# EAGLE schematic reprap_modular_electronics_slave (EAGLE 5.11)
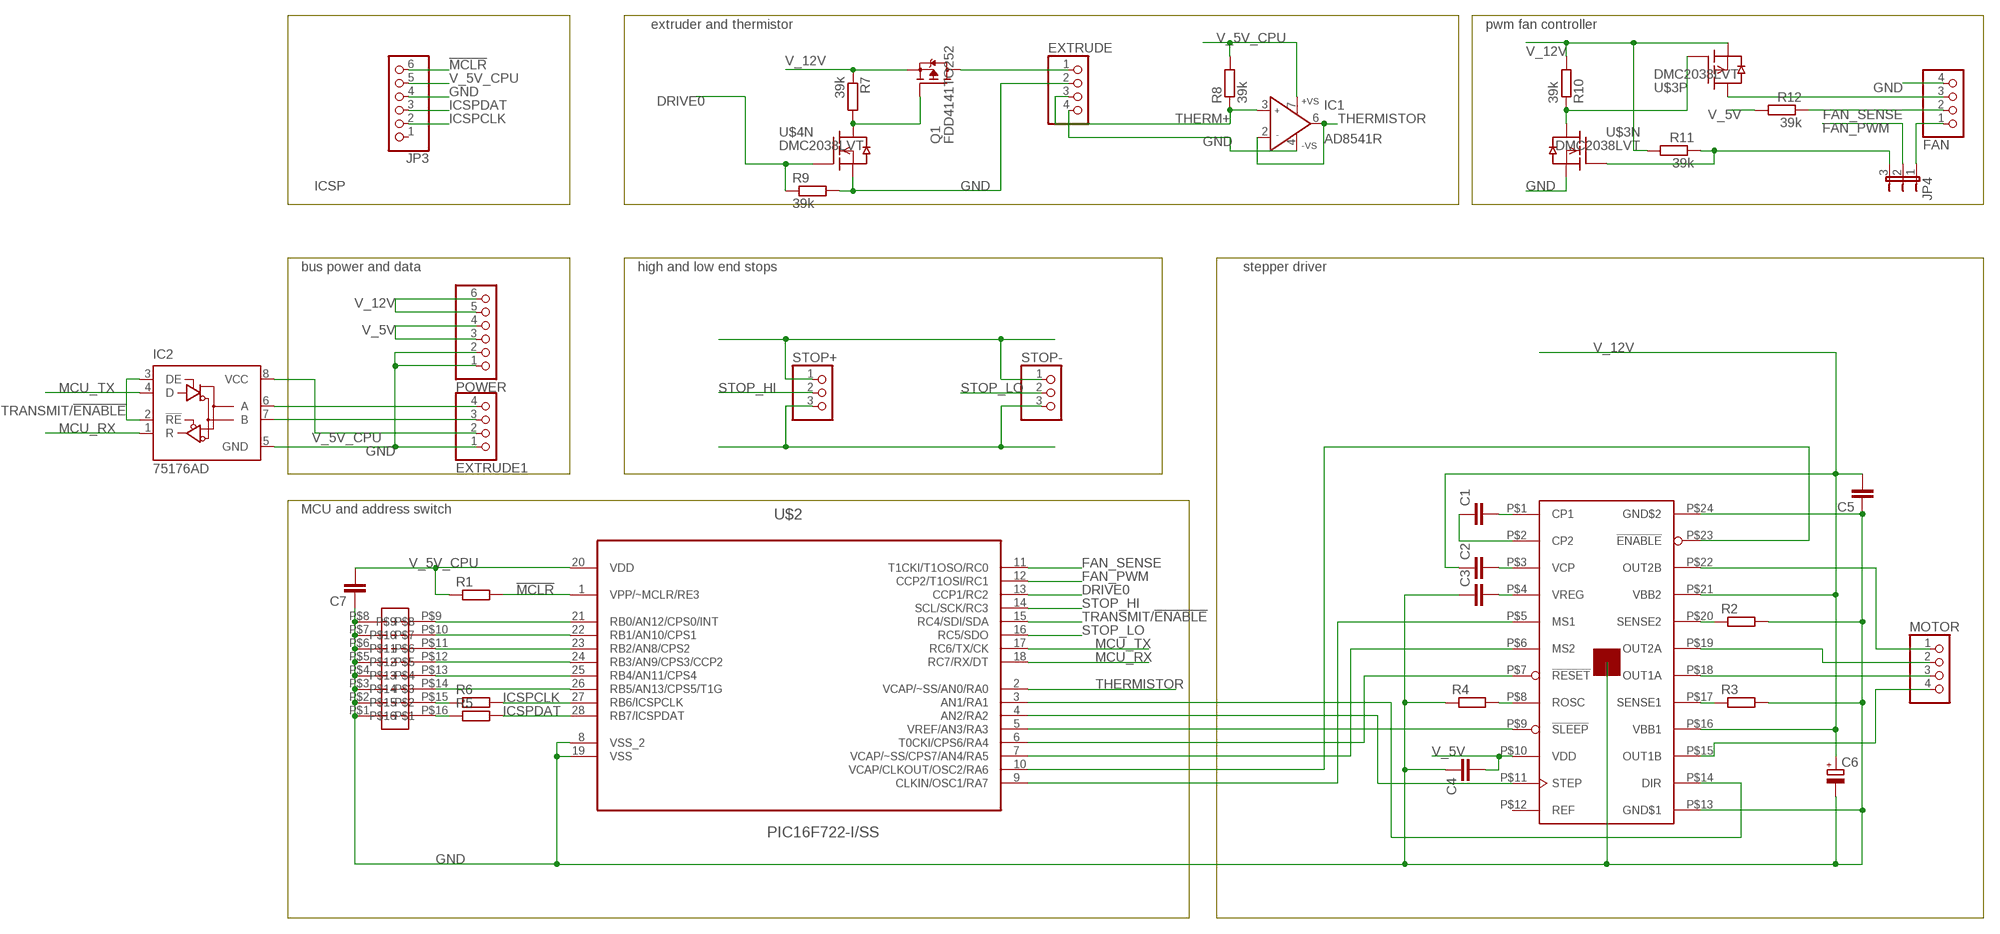
[diagram p0: schematic, sheet 1]

## Parts
ADDRESS  8WAYJUMPER  [8WAYJUMPER]
C1  C-EUC0603K  [C0603K]
C2  C-EUC0603K  [C0603K]
C3  C-EUC0603K  [C0603K]
C4  C-EUC0603K  [C0603K]
C5  C-EUC0603K  [C0603K]
C6  CPOL-EUE2-5  [E2-5]
C7  C-EUC0603K  [C0603K]
EXTRUDE  PINHD-1X4/90  [1X04/90]
EXTRUDE1  PINHD-1X4/90  [1X04/90]
FAN  PINHD-1X4/90  [1X04/90]
IC1  AD8541R  [SO8]
IC2  75176AD  [D_R-PDSO-G8]
JP3  PINHD-1X6/90  [1X06/90]
JP4  JP2E  [JP2]
MOTOR  PINHD-1X4/90  [1X04/90]
POWER  PINHD-1X6/90  [1X06/90]
Q1  FDD4141TO252  [TO252]
R1  R-EU_R0603  [R0603]
R2  R-EU_R0805  [R0805]
R3  R-EU_R0805  [R0805]
R4  R-EU_R0603  [R0603]
R5  R-EU_R0603  [R0603]
R6  R-EU_R0603  [R0603]
R7  39k  R-EU_R0603  [R0603]
R8  39k  R-EU_R0603  [R0603]
R9  39k  R-EU_R0603  [R0603]
R10  39k  R-EU_R0603  [R0603]
R11  39k  R-EU_R0603  [R0603]
R12  39k  R-EU_R0603  [R0603]
STOP+  PINHD-1X3/90  [1X03/90]
STOP-  PINHD-1X3/90  [1X03/90]
U$1  A4982  [TSSOP24]
U$2  PIC16F722-I/SS  [SOP65P780X200-28N]
U$3  DMC2038LVT  [SOT23-6]
U$4  DMC2038LVT  [SOT23-6]

## Nets
!ENABLE: U$1.P$23(!ENABLE) U$2.10(VCAP/CLKOUT/OSC2/RA6)
!MCLR: JP3.6 R1.2 U$2.1(VPP/~MCLR/RE3)
!RESET: U$1.P$7(!RESET) U$2.6(T0CKI/CPS6/RA4)
!SLEEP: U$1.P$9(!SLEEP) U$2.5(VREF/AN3/RA3)
DIR: U$1.P$14(DIR) U$2.3(AN1/RA1)
DRIVE0: R9.1 U$2.13(CCP1/RC2) U$4.1(N:G)
FAN_POWER: FAN.3 U$3.4(P:D)
FAN_PWM: JP4.2 U$2.12(CCP2/T1OSI/RC1)
FAN_SENSE: FAN.2 R12.1 U$2.11(T1CKI/T1OSO/RC0)
GND: ADDRESS.P$1 ADDRESS.P$2 ADDRESS.P$3 ADDRESS.P$4 ADDRESS.P$5 ADDRESS.P$6 ADDRESS.P$7 ADDRESS.P$8 C3.1 C4.1 C5.1 C6.- C7.1 EXTRUDE1.1 EXTRUDE.2 EXTRUDE.4 FAN.4 IC1.4(-VS) IC2.5(GND) JP3.4 POWER.1 POWER.2 R2.2 R3.2 R4.1 R9.2 STOP+.3 STOP-.3 U$1.EP(GND$0) U$1.P$13(GND$1) U$1.P$24(GND$2) U$2.8(VSS_2) U$2.19(VSS) U$3.5(N:S) U$4.5(N:S)
ICSPCLK: JP3.2 R6.2 U$2.27(RB6/ICSPCLK)
ICSPDAT: JP3.3 R5.2 U$2.28(RB7/ICSPDAT)
MCU_RX: IC2.1(R) U$2.18(RC7/RX/DT)
MCU_TX: IC2.4(D) U$2.17(RC6/TX/CK)
MS2: U$1.P$6(MS2) U$2.7(VCAP/~SS/CPS7/AN4/RA5)
N$1: EXTRUDE.1 Q1.2(D)
N$2: U$1.P$5(MS1) U$2.9(CLKIN/OSC1/RA7)
N$3: R10.1 U$3.3(P:G) U$3.6(N:D)
N$4: FAN.1 JP4.1
N$6: Q1.1(G) R7.2 U$4.6(N:D)
N$7: JP4.3 R11.1 U$3.1(N:G)
N$8: MOTOR.1 U$1.P$22(OUT2B)
N$9: MOTOR.2 U$1.P$19(OUT2A)
N$10: MOTOR.3 U$1.P$18(OUT1A)
N$11: MOTOR.4 U$1.P$15(OUT1B)
N$12: R2.1 U$1.P$20(SENSE2)
N$13: R3.1 U$1.P$17(SENSE1)
N$14: C1.2 U$1.P$1(CP1)
N$15: C1.1 U$1.P$2(CP2)
N$16: C2.2 U$1.P$3(VCP)
N$17: C3.2 U$1.P$4(VREG)
N$18: ADDRESS.P$16 R5.1
N$19: ADDRESS.P$15 R6.1
N$20: R4.2 U$1.P$8(ROSC)
N$21: ADDRESS.P$9 U$2.21(RB0/AN12/CPS0/INT)
N$22: ADDRESS.P$10 U$2.22(RB1/AN10/CPS1)
N$23: ADDRESS.P$11 U$2.23(RB2/AN8/CPS2)
N$24: ADDRESS.P$12 U$2.24(RB3/AN9/CPS3/CCP2)
N$25: ADDRESS.P$13 U$2.25(RB4/AN11/CPS4)
N$26: ADDRESS.P$14 U$2.26(RB5/AN13/CPS5/T1G)
N$29: EXTRUDE1.4 IC2.6(A)
N$30: EXTRUDE1.3 IC2.7(B)
STEP: U$1.P$11(STEP) U$2.4(AN2/RA2)
STOP_HI: STOP+.2 U$2.14(SCL/SCK/RC3)
STOP_LO: STOP-.2 U$2.16(RC5/SDO)
THERM+: EXTRUDE.3 IC1.3(IN+) R8.1
THERMISTOR: IC1.2(IN-) IC1.6(OUT) U$2.2(VCAP/~SS/AN0/RA0)
TRANSMIT/!ENABLE: IC2.2(!RE) IC2.3(DE) U$2.15(RC4/SDI/SDA)
V_5V: C4.2 POWER.3 POWER.4 R12.2 STOP+.1 STOP-.1 U$1.P$10(VDD)
V_5V_CPU: C7.2 EXTRUDE1.2 IC1.7(+VS) IC2.8(VCC) JP3.5 R1.1 R8.2 U$2.20(VDD)
V_12V: C2.1 C5.2 C6.+ POWER.5 POWER.6 Q1.3(S) R7.1 R10.2 R11.2 U$1.P$16(VBB1) U$1.P$21(VBB2) U$3.2(P:S)
Unconnected: JP3.1 U$1.P$12(REF) U$4.2(P:S) U$4.3(P:G) U$4.4(P:D)

## Notes on the sheet
- extruder and thermistor | pwm fan controller
- ICSP
- bus power and data | high and low end stops | stepper driver
- MCU and address switch

## Library data of the parts
ADDRESS = ics:8WAYJUMPER
C1-C5 C7 = rcl:C-EU: CAPACITOR, European symbol
C6 = resistor:CPOL-EU: POLARIZED CAPACITOR, European symbol
EXTRUDE EXTRUDE1 FAN MOTOR = pinhead:PINHD-1X4: PIN HEADER
IC1 = analog-devices:AD8541: General-Purpose CMOS Rail-to-Rail Amplifiers Source: http://www.analog.com/static/imported-files/data_sheets/AD8541_8542_8544.pdf; MPN: AD8541ARZ; OC_FARNELL: 9603859; OC_NEWARK: 31M4547
IC2 = 751xx:75176A: DIFFERENTIAL BUS TRANSCEIVER Source: http://focus.ti.com/lit/ds/symlink/sn75176a.pdf
JP3 POWER = pinhead:PINHD-1X6: PIN HEADER
JP4 = jumper:JP2E: JUMPER
Q1 = transistor-fet:FDD4141: P-Channel PowerTrench® MOSFET Source: FDD4141.pdf
R1 R5-R12 = rcl:R-EU_: RESISTOR, European symbol
R2-R4 = resistor:R-EU_: RESISTOR, European symbol
STOP+ STOP- = pinhead:PINHD-1X3: PIN HEADER
U$1 = ics:A4982
U$2 = ics:PIC16F722-I/SS: 8-Bit CMOS Microcontrollers; MPN: PIC16F722-I/SS; OC_FARNELL: 1630147; OC_NEWARK: 54M4996; PACKAGE: SOP-28; SUPPLIER: Microchip
U$3 U$4 = ics:DMC2038LVT